# Altium schematic sheet USBC.SchDoc
size A; SheetNumber: 3; SheetTotal: 3
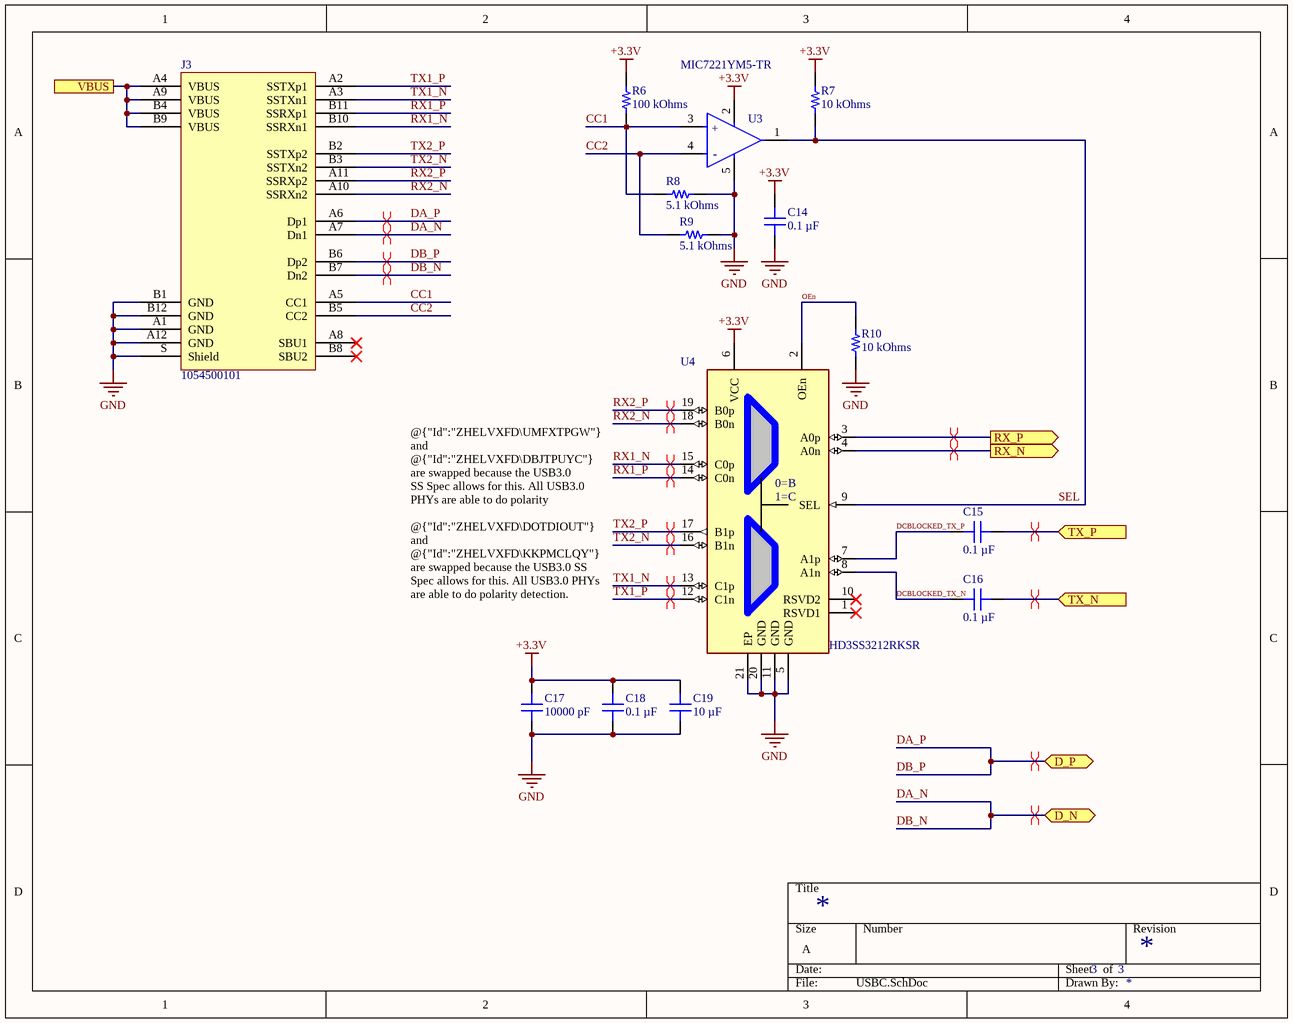
[diagram p0: USBC.SchDoc]

## Parts
C14  0.1 µF  [CAP 0603_1608]
C15  0.1 µF  [CAP 0603_1608]
C16  0.1 µF  [CAP 0603_1608]
C17  10000 pF  [CAP 0603_1608]
C18  0.1 µF  [CAP 0603_1608]
C19  10 µF  [CAP 0603_1608]
J3  1054500101  [Molex 1054500101]
R6  100 kOhms  [RES 0603_1608]
R7  10 kOhms  [RES 0603_1608]
R8  5.1 kOhms  [RES 0603_1608]
R9  5.1 kOhms  [RES 0603_1608]
R10  10 kOhms  [RES 0603_1608]
U3  MIC7221YM5-TR  [FP-SOT23-5LD-PL-1-IPC_B]
U4  HD3SS3212RKSR  [FP-RKS0020A-MFG]

## Ports
D_N (bidir), D_P (bidir), RX_N (out), RX_P (out), TX_N (in), TX_P (in), VBUS

## Nets
+3.3V: C14.2 C17.2 C18.1 C19.2 R6.2 R7.2 U3.2(V+) U4.6(VCC)
GND: C14.1 C17.1 C18.2 C19.1 J3.A1(GND) J3.A12(GND) J3.B1(GND) J3.B12(GND) J3.S(Shield) R8.2 R9.2 R10.1 U3.5(V-) U4.5(GND) U4.11(GND) U4.20(GND) U4.21(EP)
CC1: J3.A5(CC1) R6.1 R8.1 U3.3(IN+)
CC2: J3.B5(CC2) R9.1 U3.4(IN-)
DA_N: J3.A7(Dn1) J3.B7(Dn2) ; port D_N  [also labelled DB_N]
DA_P: J3.A6(Dp1) J3.B6(Dp2) ; port D_P  [also labelled DB_P]
DCBLOCKED_TX_N: C16.1 U4.8(A1n)
DCBLOCKED_TX_P: C15.1 U4.7(A1p)
OEn: R10.2 U4.2(OEn)
RX1_N: J3.B10(SSRXn1) U4.15(C0p)
RX1_P: J3.B11(SSRXp1) U4.14(C0n)
RX2_N: J3.A10(SSRXn2) U4.18(B0n)
RX2_P: J3.A11(SSRXp2) U4.19(B0p)
RX_N: U4.4(A0n) ; port RX_N
RX_P: U4.3(A0p) ; port RX_P
SEL: R7.1 U3.1(OUT) U4.9(SEL)
TX1_N: J3.A3(SSTXn1) U4.13(C1p)
TX1_P: J3.A2(SSTXp1) U4.12(C1n)
TX2_N: J3.B3(SSTXn2) U4.16(B1n)
TX2_P: J3.B2(SSTXp2) U4.17(B1p)
TX_N: C16.2 ; port TX_N
TX_P: C15.2 ; port TX_P
VBUS: J3.A4(VBUS) J3.A9(VBUS) J3.B4(VBUS) J3.B9(VBUS) ; port VBUS

Not connected (* = marked no-connect by the designer): J3 A8(SBU1)* B8(SBU2)*; U4 1(RSVD1)* 10(RSVD2)*

## Layout directives
differential pair: DA_N, DA_P, RX1_N, RX1_P, RX2_N, RX2_P, RX_N, RX_P, TX1_N, TX1_P, TX2_N, TX2_P, TX_N, TX_P

## Notes on the sheet
- @{"Id":"ZHELVXFD\UMFXTPGW"} and @{"Id":"ZHELVXFD\DBJTPUYC"} are swapped because the USB3.0 SS Spec allows for this. All USB3.0 PHYs are able to do polarity detection.
- @{"Id":"ZHELVXFD\DOTDIOUT"} and @{"Id":"ZHELVXFD\KKPMCLQY"} are swapped because the USB3.0 SS Spec allows for this. All USB3.0 PHYs are able to do polarity detection.
- (in symbol CMP-004-000003-1) +; -
- (in symbol CMP-004-000004-3) 0=B; 1=C

## Library data of the parts
C14-C16 C18 = C0603C104K5RAC7411: CAP CER 0.1UF 50V X7R 0603; manufacturer: KEMET; Tolerance: ±10%; Part Number: C0603C104K5RAC7411; Value: 0.1 µF; Applications: Bypass, Decoupling; Capacitance: 0.1 µF; componentlink1description: Datasheet; componentlink1url: https://api.kemet.com/component-edge/download/datasheet/C0603C104K5RAC7411.pdf; componentlink2description: DigiKey Link; componentlink2url: https://www.digikey.com/en/products/detail/kemet/C0603C104K5RAC7411/3317013; Device Package: 0603 (1608 Metric); lastupdated: 12/20/2023 8:09:25 PM; Lifecycle Status: Active; Minimum Order: 1; Mounting Type: Surface Mount, MLCC; Operating Temperature: -55°C ~ 125°C; Package / Case: 0603 (1608 Metric); packaging: TapeAndReel; partid: 2233; Part Status: Active; price: 0.01; series: SMD Comm X7R; Size / Dimension: 0.063" L x 0.031" W (1.60mm x 0.80mm); Supplier 1: DigiKey; Supplier Part Number 1: 399-C0603C104K5RAC7411CT-ND; Temperature Coefficient: X7R; Thickness (Max): 0.035" (0.90mm); Voltage - Rated: 50V
C17 = C0603X103K1RAC3316: CAP CER 0603 10NF 100V X7R; manufacturer: KEMET; Tolerance: ±10%; Part Number: C0603X103K1RAC3316; Value: 10000 pF; Applications: Automotive, Boardflex Sensitive; Capacitance: 10000 pF; componentlink1description: Datasheet; componentlink1url: https://api.kemet.com/component-edge/download/datasheet/C0603X103K1RAC3316.pdf; componentlink2description: DigiKey Link; componentlink2url: https://www.digikey.com/en/products/detail/kemet/C0603X103K1RAC3316/10315782; Device Package: 0603 (1608 Metric); Features: Soft Termination; lastupdated: 12/20/2023 8:09:17 PM; Lifecycle Status: Active; Minimum Order: 1; Mounting Type: Surface Mount, MLCC; Operating Temperature: -55°C ~ 125°C; Package / Case: 0603 (1608 Metric); packaging: TapeAndReel; partid: 8591; Part Status: Active; price: 0.07; Ratings: AEC-Q200; series: SMD Auto X7R VW80808; Size / Dimension: 0.063" L x 0.031" W (1.60mm x 0.80mm); Supplier 1: DigiKey; Supplier Part Number 1: 399-C0603X103K1RAC3316CT-ND; Temperature Coefficient: X7R; Thickness (Max): 0.037" (0.95mm); Voltage - Rated: 100V
C19 = GRT188R61C106ME13D: CAP CER 10UF 16V X5R 0603; manufacturer: Murata Electronics; Tolerance: ±20%; Part Number: GRT188R61C106ME13D; Value: 10 µF; Applications: Automotive; Capacitance: 10 µF; componentlink1description: Datasheet; componentlink1url: https://search.murata.co.jp/Ceramy/image/img/A01X/G101/ENG/GRT188R61C106ME13-01.pdf; componentlink2description: DigiKey Link; componentlink2url: https://www.digikey.com/en/products/detail/murata-electronics/GRT188R61C106ME13D/5416740; Device Package: 0603 (1608 Metric); lastupdated: 12/20/2023 8:09:24 PM; Lifecycle Status: Active; Minimum Order: 1; Mounting Type: Surface Mount, MLCC; Operating Temperature: -55°C ~ 85°C; Package / Case: 0603 (1608 Metric); packaging: TapeAndReel; partid: 2515; Part Status: Active; price: 0.06; Ratings: AEC-Q200; series: GRT; Size / Dimension: 0.063" L x 0.031" W (1.60mm x 0.80mm); Supplier 1: DigiKey; Supplier Part Number 1: 490-12318-1-ND; Temperature Coefficient: X5R; Thickness (Max): 0.035" (0.90mm); Voltage - Rated: 16V
J3 = 1054500101: CONN RCP USB3.1 TYPEC 24P SMD RA; Manufacturer: Molex; Connector Type: USB - C (Type - C); Current Rating (Amps): 0.25A, 1A, 5A; Gender: Receptacle; Mating Cycles: 10000; Number of Contacts: 24; Number of Ports: 1; Shielding: Shielded; Specifications: USB 3.1 (USB 3.1 Gen 2, Superspeed+); Voltage - Rated: 30VAC/DC; Part Number: 1054500101; ComponentLink1Description: Datasheet; ComponentLink1URL: https://www.molex.com/pdm_docs/ps/PS-105448-001.pdf; ComponentLink2Description: DigiKey Link; ComponentLink2URL: http://digikey.com/product-detail/en/molex/1054500101/WM12856CT-ND/5843891; LastUpdated: 6/6/2020 2:14:04 AM; Lifecycle Status: Active; Minimum Order: 1; Mounting Feature: Horizontal; Mounting Type: Surface Mount, Right Angle; Through Hole; Operating Temperature: -30°C ~ 85°C; Packaging: TapeAndReel; Part Status: Active; Price: 1.22; Series: 105445; Supplier 1: DigiKey; Supplier Part Number 1: WM12856CT-ND; Termination: Solder
R6 = RCS0603100KFKEA: RES SMD 100K OHM 1% 1/4W 0603; Manufacturer: Vishay Dale; Power (Watts): 0.25W, 1/4W; Temperature Coefficient: ±100ppm/°C; Part Number: RCS0603100KFKEA; Value: 100 kOhms; ComponentLink1Description: Datasheet; ComponentLink1URL: http://www.vishay.com/docs/20065/rcse3.pdf; ComponentLink2Description: DigiKey Link; ComponentLink2URL: https://www.digikey.com/en/products/detail/vishay-dale/RCS0603100KFKEA/5866946; Composition: Thick Film; Device Package: 0603 (1608 Metric); Features: Automotive AEC-Q200, Pulse Withstanding; Height - Seated (Max): 0.020" (0.50mm); LastUpdated: 12/20/2023 8:39:03 PM; Lifecycle Status: Active; Minimum Order: 1; Number of Terminations: 2; Operating Temperature: -55°C ~ 155°C; Package / Case: 0603 (1608 Metric); Packaging: TapeAndReel; PartId: 5363; Part Status: Active; Price: 0.01; Ratings: AEC-Q200; Resistance: 100 kOhms; Series: RCS e3; Size / Dimension: 0.061" L x 0.033" W (1.55mm x 0.85mm); Supplier 1: DigiKey; Supplier Part Number 1: 541-2800-1-ND; Supplier Device Package: 0603; Tolerance: ±1%
R7 R10 = RT0603FRE0710KL: RES SMD 10K OHM 1% 1/10W 0603; Manufacturer: Yageo; Power (Watts): 0.1W, 1/10W; Temperature Coefficient: ±50ppm/°C; Part Number: RT0603FRE0710KL; Value: 10 kOhms; ComponentLink1Description: Datasheet; ComponentLink1URL: https://www.yageo.com/upload/media/product/productsearch/datasheet/rchip/PYu-RT_1-to-0.01_RoHS_L_11.pdf; ComponentLink2Description: DigiKey Link; ComponentLink2URL: https://www.digikey.com/en/products/detail/yageo/RT0603FRE0710KL/1075040; Composition: Thin Film; Device Package: 0603 (1608 Metric); Height - Seated (Max): 0.022" (0.55mm); LastUpdated: 12/20/2023 8:39:02 PM; Lifecycle Status: Active; Minimum Order: 1; Number of Terminations: 2; Operating Temperature: -55°C ~ 155°C; Package / Case: 0603 (1608 Metric); Packaging: TapeAndReel; PartId: 5671; Part Status: Active; Price: 0.01; Resistance: 10 kOhms; Series: RT; Size / Dimension: 0.063" L x 0.031" W (1.60mm x 0.80mm); Supplier 1: DigiKey; Supplier Part Number 1: YAG2321CT-ND; Supplier Device Package: 0603; Tolerance: ±1%
R8 R9 = TNPW06035K10BYEN: RES 5.1K OHM 0.1% 1/10W 0603; Manufacturer: Vishay Dale; Power (Watts): 0.125W, 1/8W; Temperature Coefficient: ±10ppm/°C; Part Number: TNPW06035K10BYEN; Value: 5.1 kOhms; ComponentLink1Description: Datasheet; ComponentLink1URL: http://www.vishay.com/docs/28758/tnpw_e3.pdf; ComponentLink2Description: DigiKey Link; ComponentLink2URL: http://digikey.com/product-detail/en/vishay-dale/TNPW06035K10BYEN/541-9831-1-ND/9562456; Composition: Thin Film; Device Package: 0603 (1608 Metric); Features: Anti-Sulfur, Automotive AEC-Q200, Moisture Resistant; Height - Seated (Max): 0.022" (0.55mm); LastUpdated: 12/20/2023 8:39:04 PM; Lifecycle Status: Active; Minimum Order: 1; Number of Terminations: 2; Operating Temperature: -55°C ~ 155°C; Package / Case: 0603 (1608 Metric); Packaging: TapeAndReel; PartId: 5273; Part Status: Active; Price: 0.27; Ratings: AEC-Q200; Resistance: 5.1 kOhms; Series: TNPW e3; Size / Dimension: 0.061" L x 0.033" W (1.55mm x 0.85mm); Supplier 1: DigiKey; Supplier Part Number 1: 541-9831-1-ND; Supplier Device Package: 0603; Tolerance: ±0.1%
U3 = CMP-004-000003-1: Comparator, 1 Func, 10000uV Offset-Max, 75ns Response Time, CMOS, PDSO5
U4 = CMP-004-000004-3: Differential Multiplexer, 2 Func, 2 Channel, PQCC20